# Altium schematic sheet PLWD_TopSheet.SchDoc
size A4; SheetNumber: 1; SheetTotal: 11
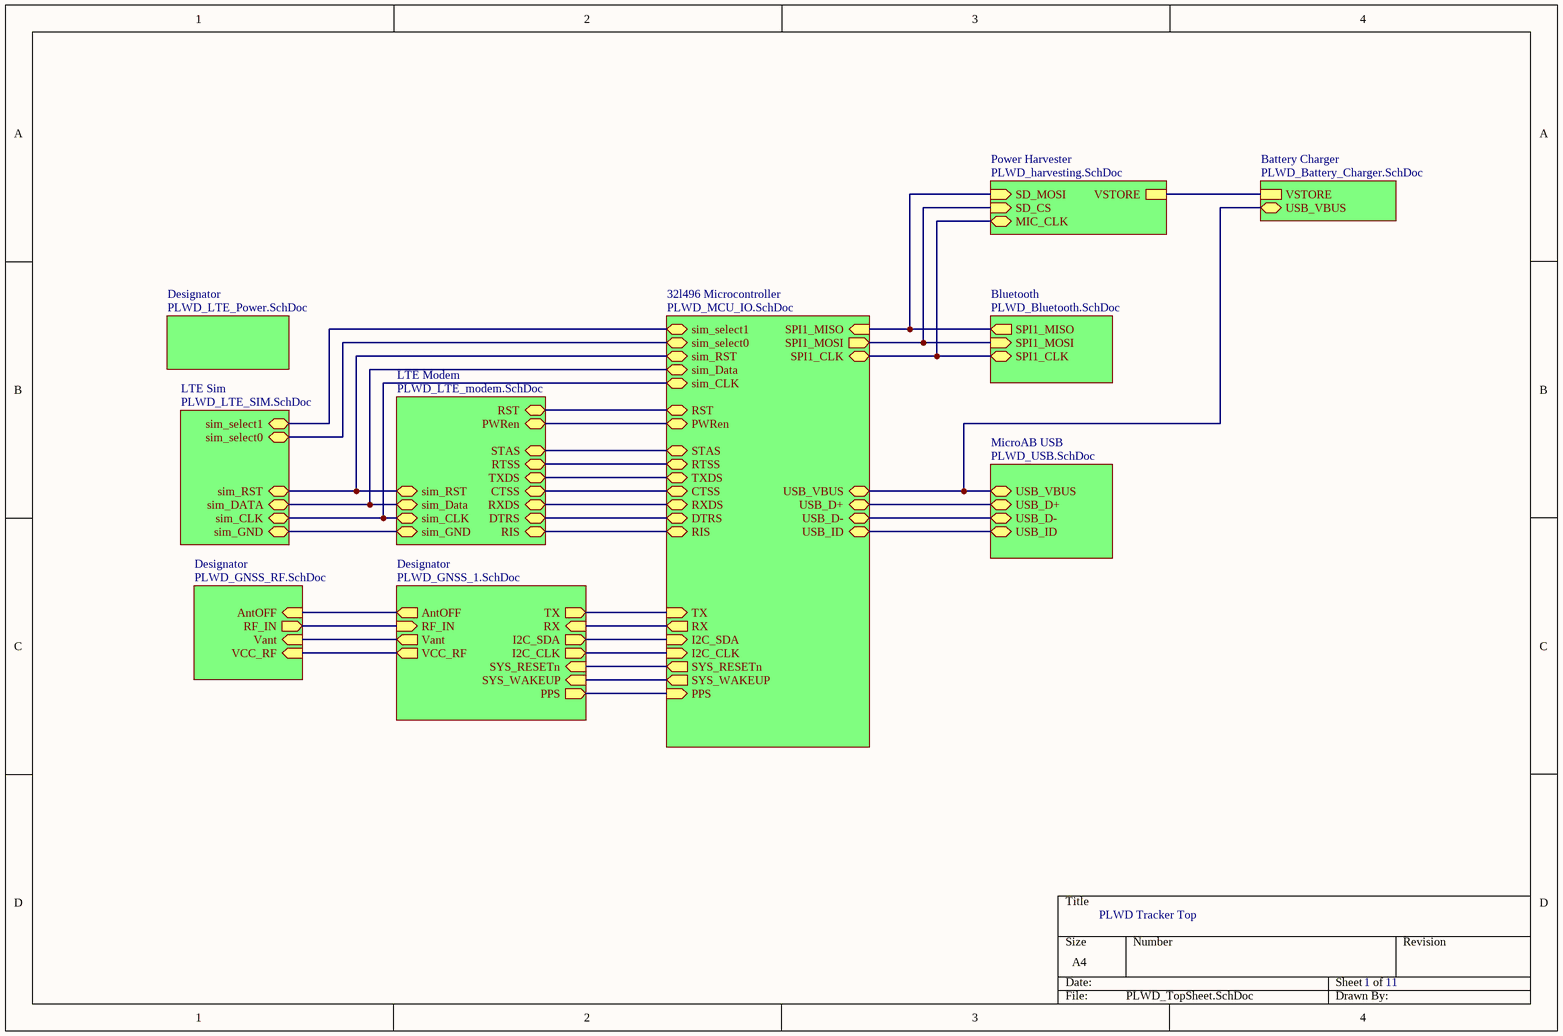
[diagram p0: PLWD_TopSheet.SchDoc]

## Sub-sheets
32l496 Microcontroller = PLWD_MCU_IO.SchDoc: SPI1_MISO (in), SPI1_MOSI (out), USB_VBUS (bidir), USB_D+ (bidir), USB_D- (bidir), USB_ID (bidir), STAS (bidir), RTSS (bidir), TXDS (bidir), CTSS (bidir), RXDS (bidir), DTRS (bidir), RIS (bidir), PWRen (bidir), RST (bidir), sim_CLK (bidir), sim_Data (bidir), sim_RST (bidir), sim_select1 (bidir), sim_select0 (bidir), TX (in), RX (out), I2C_SDA (in), I2C_CLK (in), SYS_WAKEUP (out), PPS (in), SYS_RESETn (out), SPI1_CLK (bidir)
Battery Charger = PLWD_Battery_Charger.SchDoc: VSTORE, USB_VBUS (bidir)
Bluetooth = PLWD_Bluetooth.SchDoc: SPI1_MISO (out), SPI1_MOSI (in), SPI1_CLK (bidir)
Designator = PLWD_GNSS_RF.SchDoc: AntOFF (in), RF_IN (out), Vant (in), VCC_RF (in)
Designator = PLWD_GNSS_1.SchDoc: TX (out), RX (in), I2C_SDA (out), SYS_RESETn (in), I2C_CLK (out), SYS_WAKEUP (in), PPS (out), AntOFF (out), RF_IN (in), Vant (out), VCC_RF (out)
Designator = PLWD_LTE_Power.SchDoc: no entries
LTE Modem = PLWD_LTE_modem.SchDoc: sim_GND (bidir), sim_CLK (bidir), sim_Data (bidir), sim_RST (bidir), PWRen (bidir), RST (bidir), RIS (bidir), DTRS (bidir), RXDS (bidir), CTSS (bidir), TXDS (bidir), RTSS (bidir), STAS (bidir)
LTE Sim = PLWD_LTE_SIM.SchDoc: sim_GND (bidir), sim_DATA (bidir), sim_RST (bidir), sim_select0 (bidir), sim_CLK (bidir), sim_select1 (bidir)
MicroAB USB = PLWD_USB.SchDoc: USB_VBUS (bidir), USB_D+ (bidir), USB_D- (bidir), USB_ID (bidir)
Power Harvester = PLWD_harvesting.SchDoc: MIC_CLK (bidir), SD_MOSI (in), SD_CS (in), VSTORE

## Nets
(unnamed): sheet 32l496 Microcontroller/SPI1_MISO, sheet Bluetooth/SPI1_MISO, sheet Power Harvester/SD_MOSI
(unnamed): sheet 32l496 Microcontroller/SPI1_MOSI, sheet Bluetooth/SPI1_MOSI, sheet Power Harvester/SD_CS
(unnamed): sheet 32l496 Microcontroller/USB_VBUS, sheet MicroAB USB/USB_VBUS, sheet Battery Charger/USB_VBUS
(unnamed): sheet 32l496 Microcontroller/USB_D+, sheet MicroAB USB/USB_D+
(unnamed): sheet 32l496 Microcontroller/USB_D-, sheet MicroAB USB/USB_D-
(unnamed): sheet 32l496 Microcontroller/USB_ID, sheet MicroAB USB/USB_ID
(unnamed): sheet 32l496 Microcontroller/STAS, sheet LTE Modem/STAS
(unnamed): sheet 32l496 Microcontroller/RTSS, sheet LTE Modem/RTSS
(unnamed): sheet 32l496 Microcontroller/TXDS, sheet LTE Modem/TXDS
(unnamed): sheet 32l496 Microcontroller/CTSS, sheet LTE Modem/CTSS
(unnamed): sheet 32l496 Microcontroller/RXDS, sheet LTE Modem/RXDS
(unnamed): sheet 32l496 Microcontroller/DTRS, sheet LTE Modem/DTRS
(unnamed): sheet 32l496 Microcontroller/RIS, sheet LTE Modem/RIS
(unnamed): sheet 32l496 Microcontroller/PWRen, sheet LTE Modem/PWRen
(unnamed): sheet 32l496 Microcontroller/RST, sheet LTE Modem/RST
(unnamed): sheet 32l496 Microcontroller/sim_CLK, sheet LTE Modem/sim_CLK, sheet LTE Sim/sim_CLK
(unnamed): sheet 32l496 Microcontroller/sim_Data, sheet LTE Modem/sim_Data, sheet LTE Sim/sim_DATA
(unnamed): sheet 32l496 Microcontroller/sim_RST, sheet LTE Modem/sim_RST, sheet LTE Sim/sim_RST
(unnamed): sheet 32l496 Microcontroller/sim_select1, sheet LTE Sim/sim_select1
(unnamed): sheet 32l496 Microcontroller/sim_select0, sheet LTE Sim/sim_select0
(unnamed): sheet 32l496 Microcontroller/TX, sheet Designator/TX
(unnamed): sheet 32l496 Microcontroller/RX, sheet Designator/RX
(unnamed): sheet 32l496 Microcontroller/I2C_SDA, sheet Designator/I2C_SDA
(unnamed): sheet 32l496 Microcontroller/I2C_CLK, sheet Designator/I2C_CLK
(unnamed): sheet 32l496 Microcontroller/SYS_WAKEUP, sheet Designator/SYS_WAKEUP
(unnamed): sheet 32l496 Microcontroller/PPS, sheet Designator/PPS
(unnamed): sheet 32l496 Microcontroller/SYS_RESETn, sheet Designator/SYS_RESETn
(unnamed): sheet 32l496 Microcontroller/SPI1_CLK, sheet Bluetooth/SPI1_CLK, sheet Power Harvester/MIC_CLK
(unnamed): sheet Designator/AntOFF, sheet Designator/AntOFF
(unnamed): sheet Designator/RF_IN, sheet Designator/RF_IN
(unnamed): sheet Designator/Vant, sheet Designator/Vant
(unnamed): sheet Designator/VCC_RF, sheet Designator/VCC_RF
(unnamed): sheet Power Harvester/VSTORE, sheet Battery Charger/VSTORE
(unnamed): sheet LTE Modem/sim_GND, sheet LTE Sim/sim_GND

## Notes on the sheet
- PLWD Tracker Top
- 1
- 11